# Altium schematic sheet Sheet1.SchDoc
size A4
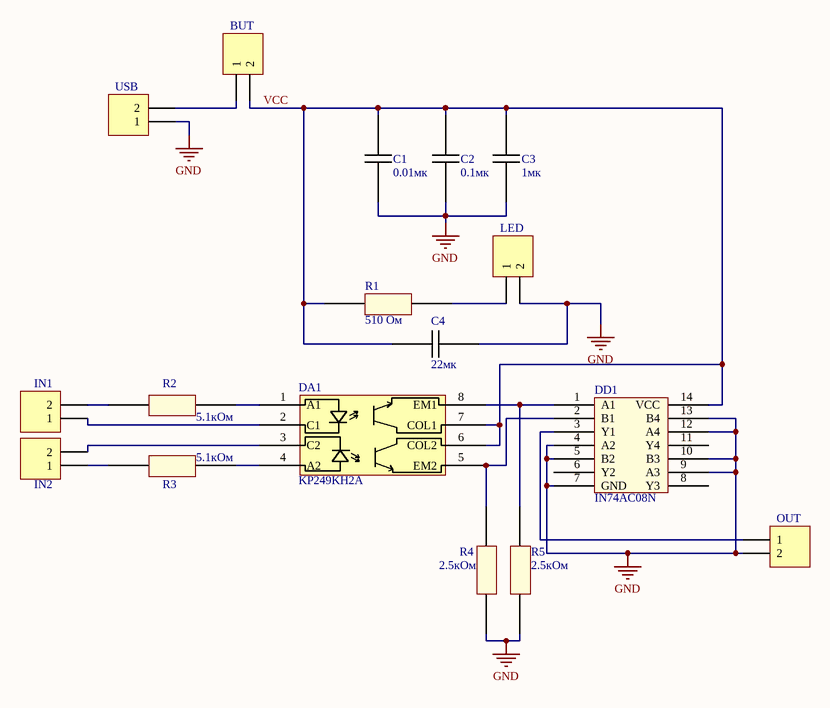
[diagram p0: Sheet1.SchDoc]

## Parts
C1  0.01мк  [RES 0805]
C2  0.1мк  [RES 0805]
C3  1мк  [RES 0805]
C4  22мк  [RES 0805]
DA1  KP249KH2A  [SCS-8]
DD1  IN74AC08N  [SCS-14]
P1  BUT  [HDR1X2]
P2  USB  [HDR1X2]
P3  LED  [HDR1X2]
P4  IN2  [HDR1X2]
P5  IN1  [HDR1X2]
P6  OUT  [HDR1X2]
R1  510 Ом  [RES 0805]
R2  5.1кОм  [RES 0805]
R3  5.1кОм  [RES 0805]
R4  2.5кОм  [RES 0805]
R5  2.5кОм  [RES 0805]

## Nets
GND: C1.1 C2.1 C3.1 C4.1 DD1.4(A2) DD1.5(B2) DD1.7(GND) DD1.9(A3) DD1.10(B3) DD1.12(A4) DD1.13(B4) P2.1 P3.2 P6.2 R4.1 R5.1
VCC: C1.2 C2.2 C3.2 C4.2 DA1.6(COL2) DA1.7(COL1) DD1.14(VCC) P1.2 R1.1
NetDA1_1: DA1.1(A1) R2.2
NetDA1_2: DA1.2(C1) P5.1
NetDA1_3: DA1.3(C2) P4.2
NetDA1_4: DA1.4(A2) R3.2
NetDA1_5: DA1.5(EM2) DD1.2(B1) R4.2
NetDA1_8: DA1.8(EM1) DD1.1(A1) R5.2
NetDD1_3: DD1.3(Y1) P6.1
NetP1_1: P1.1 P2.2
NetP3_1: P3.1 R1.2
NetP4_1: P4.1 R3.1
NetP5_2: P5.2 R2.1

Not connected (* = marked no-connect by the designer): DD1 6(Y2) 8(Y3) 11(Y4)

## Library data of the parts
C1-C4 = CAP
P1-P6 = Header 2: Header, 2-Pin; LatestRevisionDate: 17-Jul-2002; LatestRevisionNote: Re-released for DXP Platform.; Publisher: Altium Limited
R1-R5 = RES